# Altium schematic sheet HGD(v0.1)-20200419.SchDoc
size A2; SheetNumber: 0; SheetTotal: 0; PageSetup: Record=PageOptions|CenterHorizontal=True|CenterVertical=True|PrintScale=0.71|XCorrection=1.00|YCorrection=1.00|PrintKind=2|BorderSize=5000000|LeftOffset=0|BottomOffset=0|Orientation=2|PaperLength=1000|PaperWidth=1000|Scale=100|PaperSource=7|PrintQuality=-4|MediaType=1|DitherType=10|PaperKind=A3|PrintScaleMode=1
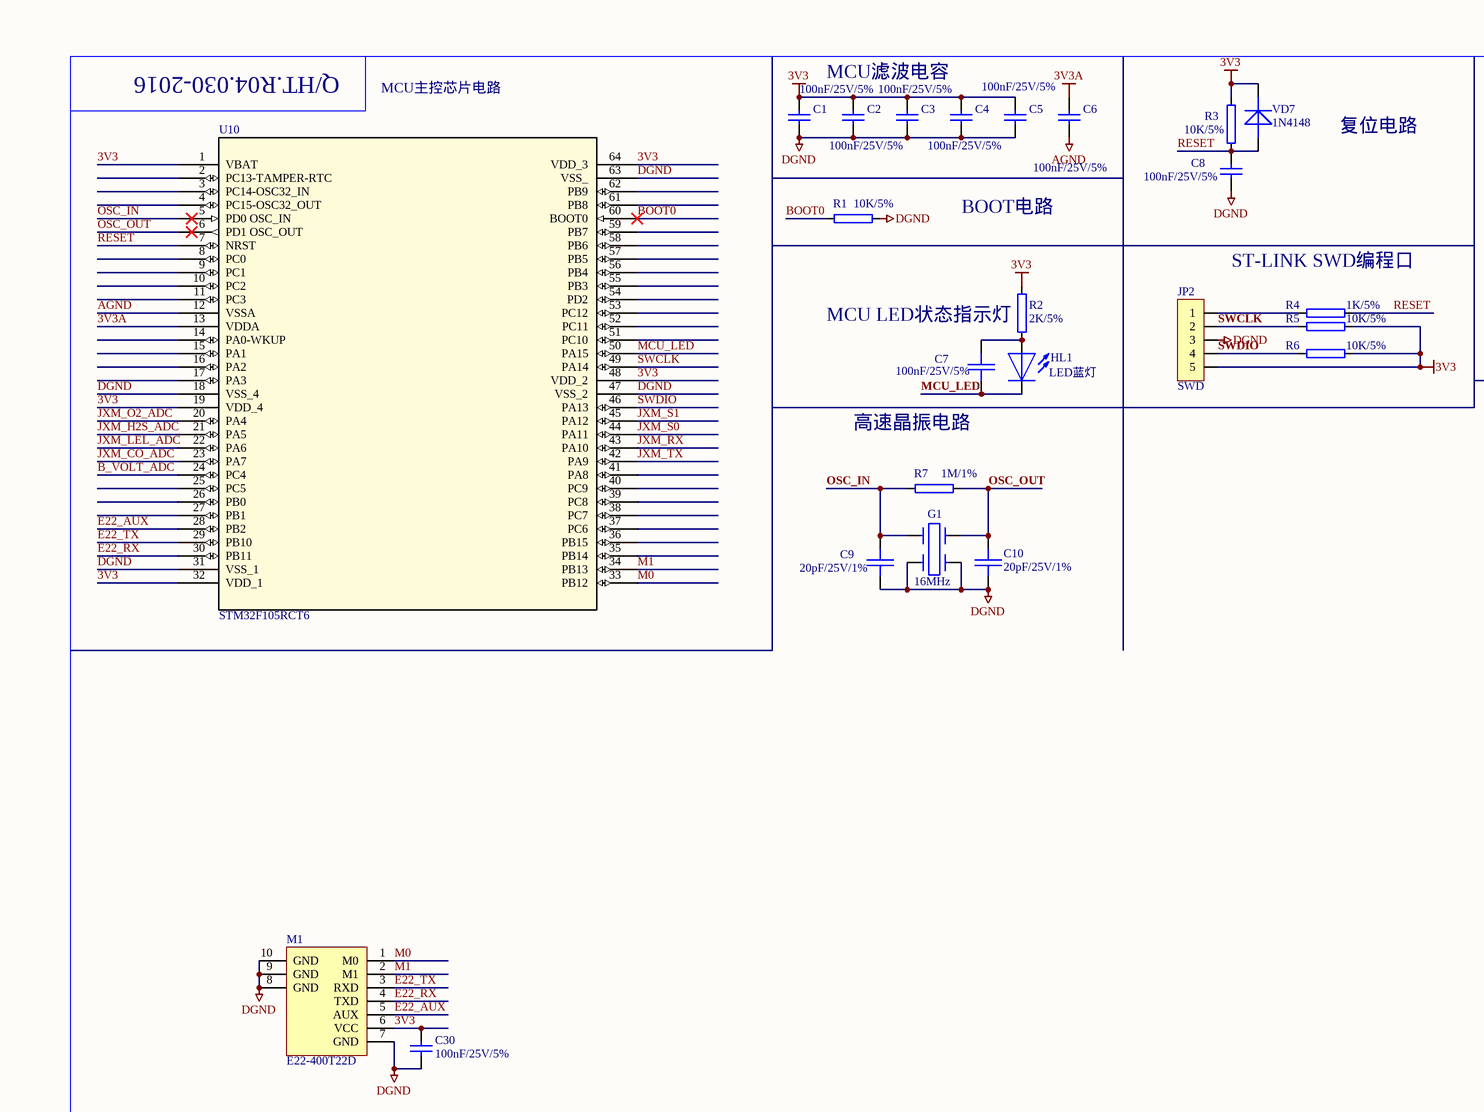
[diagram p0: HGD(v0.1)-20200419.SchDoc, top left]
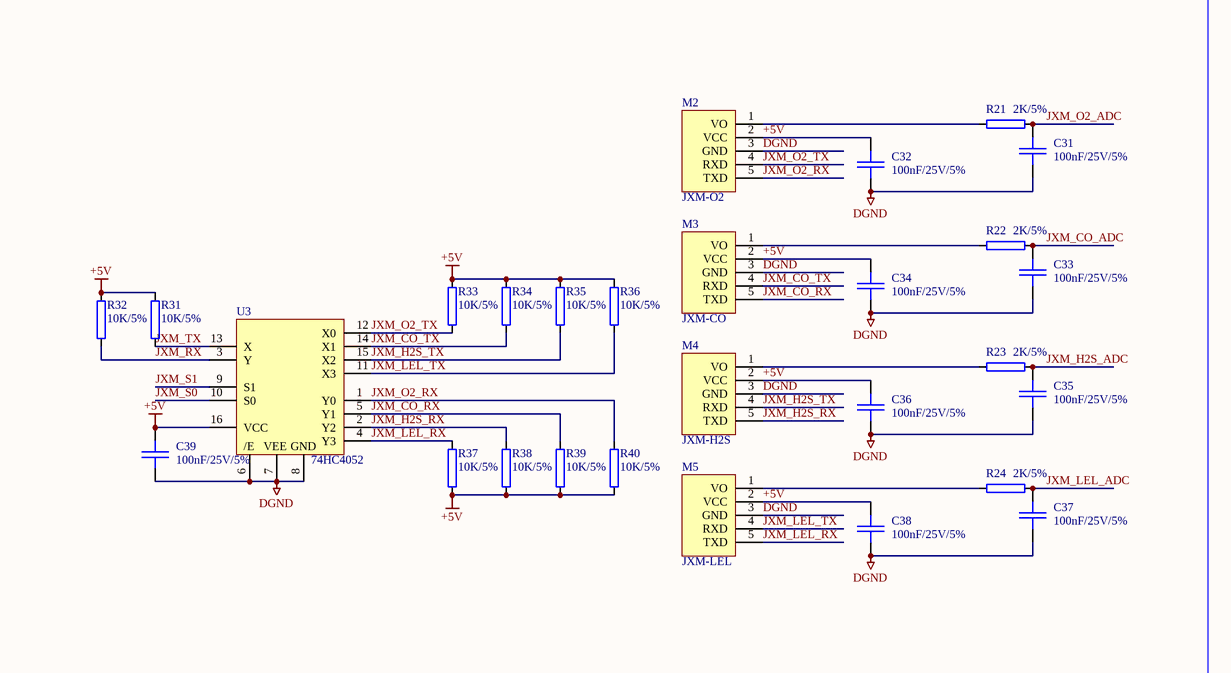
[diagram p1: HGD(v0.1)-20200419.SchDoc, top right]
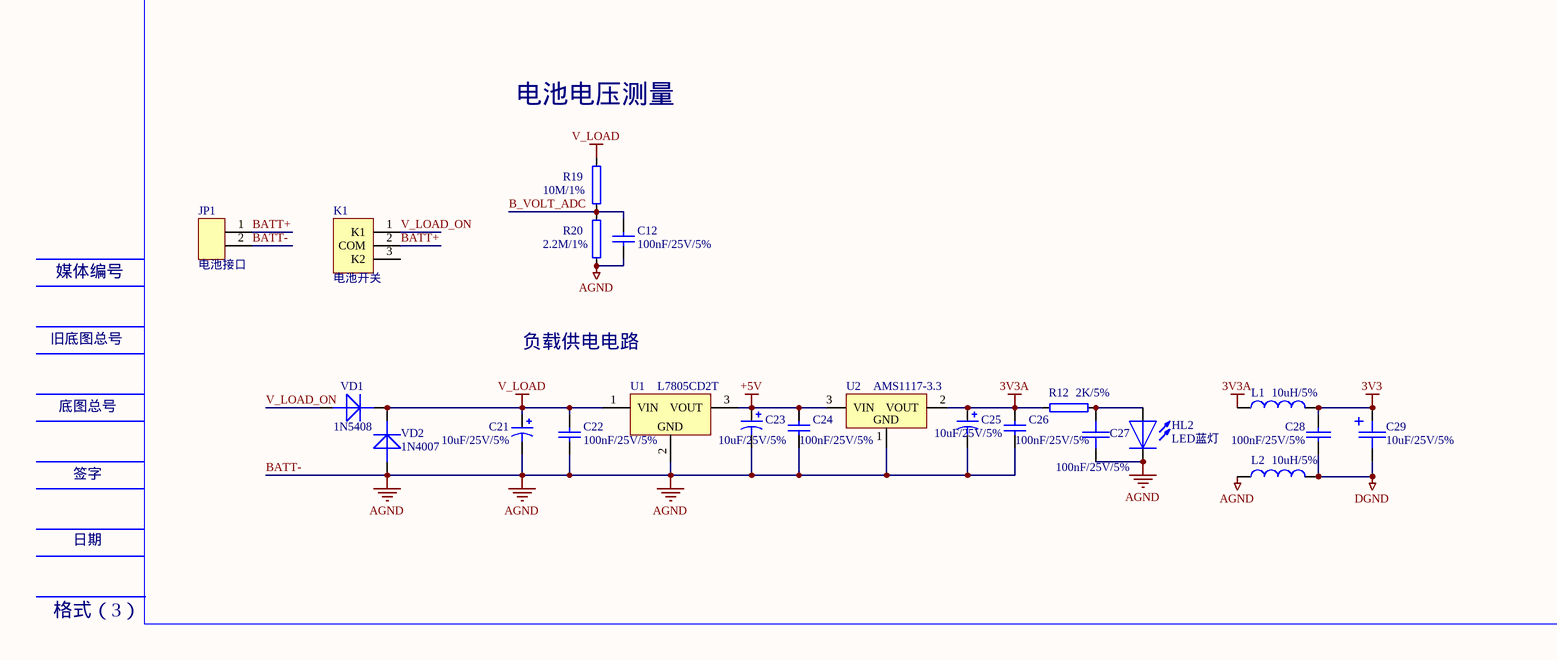
[diagram p2: HGD(v0.1)-20200419.SchDoc, bottom left]
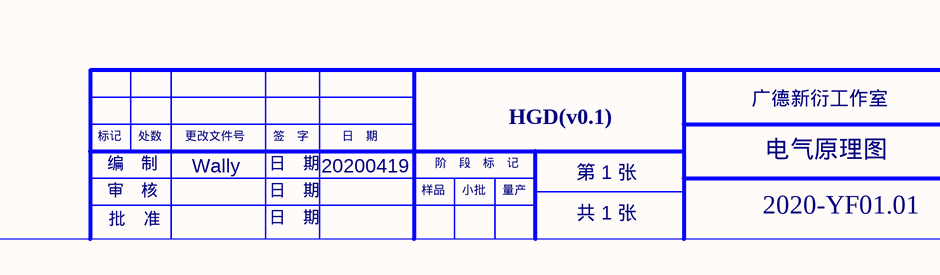
[diagram p3: HGD(v0.1)-20200419.SchDoc, bottom right]

## Parts
C1  100nF/25V/5%  [C0603]
C2  100nF/25V/5%  [C0603]
C3  100nF/25V/5%  [C0603]
C4  100nF/25V/5%  [C0603]
C5  100nF/25V/5%  [C0603]
C6  100nF/25V/5%  [C0603]
C7  100nF/25V/5%  [C0603]
C8  100nF/25V/5%  [C0603]
C9  20pF/25V/1%  [C0603]
C10  20pF/25V/1%  [C0603]
C12  100nF/25V/5%  [C0603]
C21  10uF/25V/5%  [C1206-1]
C22  100nF/25V/5%  [C0603]
C23  10uF/25V/5%  [C1206-1]
C24  100nF/25V/5%  [C0603]
C25  10uF/25V/5%  [C1206-1]
C26  100nF/25V/5%  [C0603]
C27  100nF/25V/5%  [C0603]
C28  100nF/25V/5%  [C0603]
C29  10uF/25V/5%  [C1206-1]
C30  100nF/25V/5%  [C0603]
C31  100nF/25V/5%  [C0603]
C32  100nF/25V/5%  [C0603]
C33  100nF/25V/5%  [C0603]
C34  100nF/25V/5%  [C0603]
C35  100nF/25V/5%  [C0603]
C36  100nF/25V/5%  [C0603]
C37  100nF/25V/5%  [C0603]
C38  100nF/25V/5%  [C0603]
C39  100nF/25V/5%  [C0603]
G1  16MHz  [OSC5032]
HL1  LED蓝灯  [LED0603]
HL2  LED蓝灯  [LED0603]
JP1  电池接口  [XH2.54-LI-2P]
JP2  SWD  [XH2.54-5AW]
K1  电池开关  [SK-12D07]
L1  10uH/5%  [L0603]
L2  10uH/5%  [L0603]
M1  E22-400T22D  [E22-400T22D]
M2  JXM-O2  [JXM]
M3  JXM-CO  [JXM]
M4  JXM-H2S  [JXM]
M5  JXM-LEL  [JXM]
R1  10K/5%  [R0603]
R2  2K/5%  [R0603]
R3  10K/5%  [R0603]
R4  1K/5%  [R0603]
R5  10K/5%  [R0603]
R6  10K/5%  [R0603]
R7  1M/1%  [R0603]
R12  2K/5%  [R0603]
R19  10M/1%  [R0603]
R20  2.2M/1%  [R0603]
R21  2K/5%  [R0603]
R22  2K/5%  [R0603]
R23  2K/5%  [R0603]
R24  2K/5%  [R0603]
R31  10K/5%  [R0603]
R32  10K/5%  [R0603]
R33  10K/5%  [R0603]
R34  10K/5%  [R0603]
R35  10K/5%  [R0603]
R36  10K/5%  [R0603]
R37  10K/5%  [R0603]
R38  10K/5%  [R0603]
R39  10K/5%  [R0603]
R40  10K/5%  [R0603]
U1  L7805CD2T  [D2PAK]
U2  AMS1117-3.3  [SOT230P700X180-4N]
U3  74HC4052  [SO16_74HC4052]
U10  STM32F105RCT6  [LQFP64]
VD1  1N5408  [SMA_DO-214AC]
VD2  1N4007  [SMA_DO-214AC]
VD7  1N4148  [LL-34]

## Nets
3V3: C1.2 C2.1 C3.1 C4.2 C5.2 C28.2 C29.1 C30.2 JP2.5 L1.2 M1.6(VCC) R2.1 R3.2 R5.2 R6.2 U10.1(VBAT) U10.19(VDD_4) U10.32(VDD_1) U10.48(VDD_2) U10.64(VDD_3) VD7.K
3V3A: C6.2 C25.1 C26.2 L1.1 R12.1 U2.2(VOUT) U10.13(VDDA)
+5V: C23.1 C24.2 C32.1 C34.1 C36.1 C38.1 C39.1 M2.2(VCC) M3.2(VCC) M4.2(VCC) M5.2(VCC) R31.2 R32.2 R33.2 R34.2 R35.2 R36.2 R37.1 R38.1 R39.1 R40.1 U1.3(VOUT) U2.3(VIN) U3.16(VCC)
AGND: C6.1 C12.2 C21.2 C22.1 C23.2 C24.1 C25.2 C26.1 C27.2 HL2.K JP1.2 L2.1 R20.2 U1.2(GND) U2.1(GND) U10.12(VSSA) VD2.A  [also labelled BATT-]
DGND: C1.1 C2.2 C3.2 C4.1 C5.1 C8.2 C9.1 C10.2 C28.1 C29.2 C30.1 C31.2 C32.2 C33.2 C34.2 C35.2 C36.2 C37.2 C38.2 C39.2 G1.2 G1.4 JP2.3 L2.2 M1.7(GND) M1.8(GND) M1.9(GND) M1.10(GND) M2.3(GND) M3.3(GND) M4.3(GND) M5.3(GND) R1.1 U3.6(~{E}) U3.7(VEE) U3.8(GND) U10.18(VSS_4) U10.31(VSS_1) U10.47(VSS_2) U10.63(VSS_)
V_LOAD: C21.1 C22.2 R19.1 U1.1(VIN) VD1.K VD2.K
B_VOLT_ADC: C12.1 R19.2 R20.1 U10.24(PC4)
BATT+: JP1.1 K1.2(COM)
BOOT0: R1.2 U10.60(BOOT0)
E22_AUX: M1.5(AUX) U10.28(PB2)
E22_RX: M1.4(TXD) U10.30(PB11)
E22_TX: M1.3(RXD) U10.29(PB10)
JXM_CO_ADC: C33.1 R22.1 U10.23(PA7)
JXM_CO_RX: M3.5(TXD) R39.2 U3.5(Y1)
JXM_CO_TX: M3.4(RXD) R34.1 U3.14(X1)
JXM_H2S_ADC: C35.1 R23.1 U10.21(PA5)
JXM_H2S_RX: M4.5(TXD) R38.2 U3.2(Y2)
JXM_H2S_TX: M4.4(RXD) R35.1 U3.15(X2)
JXM_LEL_ADC: C37.1 R24.1 U10.22(PA6)
JXM_LEL_RX: M5.5(TXD) R37.2 U3.4(Y3)
JXM_LEL_TX: M5.4(RXD) R36.1 U3.11(X3)
JXM_O2_ADC: C31.1 R21.1 U10.20(PA4)
JXM_O2_RX: M2.5(TXD) R40.2 U3.1(Y0)
JXM_O2_TX: M2.4(RXD) R33.1 U3.12(X0)
JXM_RX: R32.1 U3.3(Y) U10.43(PA10)
JXM_S0: U3.10(S0) U10.44(PA11)
JXM_S1: U3.9(S1) U10.45(PA12)
JXM_TX: R31.1 U3.13(X) U10.42(PA9)
M0: M1.1(M0) U10.33(PB12)
M1: M1.2(M1) U10.34(PB13)
MCU_LED: C7.2 HL1.K U10.50(PA15)
OSC_IN: C9.2 G1.1 R7.1 U10.5(PD0_OSC_IN)
OSC_OUT: C10.1 G1.3 R7.2 U10.6(PD1_OSC_OUT)
RESET: C8.1 R3.1 R4.2 U10.7(NRST) VD7.A
SWCLK: JP2.2 R5.1 U10.49(PA14)
SWDIO: JP2.4 R6.1 U10.46(PA13)
V_LOAD_ON: K1.1(K1) VD1.A
NetC7_1: C7.1 HL1.A R2.2
NetC27_1: C27.1 HL2.A R12.2
NetJP2_1: JP2.1 R4.1
NetM2_1: M2.1(VO) R21.2
NetM3_1: M3.1(VO) R22.2
NetM4_1: M4.1(VO) R23.2
NetM5_1: M5.1(VO) R24.2

Not connected (* = marked no-connect by the designer): K1 3(K2); U10 2(PC13-TAMPER-RTC) 3(PC14-OSC32_IN) 4(PC15-OSC32_OUT) 8(PC0) 9(PC1) 10(PC2) 11(PC3) 14(PA0-WKUP) 15(PA1) 16(PA2) 17(PA3) 25(PC5) 26(PB0) 27(PB1) 35(PB14) 36(PB15) 37(PC6) 38(PC7) 39(PC8) 40(PC9) 41(PA8) 51(PC10) 52(PC11) 53(PC12) 54(PD2) 55(PB3) 56(PB4) 57(PB5) 58(PB6) 59(PB7) 61(PB8) 62(PB9)

## Notes on the sheet
- Q/HT.R04.030-2016
- MCU主控芯片电路
- MCU滤波电容
- 复位电路
- BOOT电路
- ST-LINK SWD编程口
- (near C7) MCU LED状态指示灯
- 高速晶振电路
- 电池电压测量
- 媒体编号
- 旧底图总号
- 负载供电电路
- 底图总号
- 签字
- HGD(v0.1)
- 广德新衍工作室
- 日期
- 标记
- 编　制
- 审　核
- 处数
- 更改文件号
- Wally
- 日　期
- 签　字
- 20200419
- 样品
- 阶　段　标　记
- 小批
- 量产
- 第 1 张
- 电气原理图
- 格式（3）
- 批    准
- 共 1 张
- 2020-YF01.01
- (in symbol 74HC4052) /E

## Library data of the parts
C1-C6 C8 = CAP-SMD: 电容
C7 C9 C10 C27 C28 C31-C39 = CAP: 电容
C12 = CAP-SMD
C21 C23 C25 = Cap Pol1: 钽电容; Published: 8-Jun-2000; LatestRevisionDate: 17-Jul-2002; LatestRevisionNote: Re-released for DXP Platform.; PackageReference: RB7.6-15; Publisher: Altium Limited; Value: 10uF/25V/5%
C22 C24 C26 C30 = Cap: 电容; Published: 8-Jun-2000; LatestRevisionDate: 17-Jul-2002; LatestRevisionNote: Re-released for DXP Platform.; PackageReference: RAD-0.3; Publisher: Altium Limited; Value: 100nF/25V/5%
C29 = ELECTRO1: 钽电容
G1 = CRYSTAL_4: 两对电极压电晶体
HL1 HL2 = 发光二极管
JP1 = XH2.54-2P/PH2.0-2P: XH2.54-2P/PH2.0-2P插座
JP2 = JP_XH2.54-5AW: XH2.54-5P直插插针
K1 = SK-12D07: SK-12D07：3脚2档小型拨动开关
L1 L2 = 电感
M1 = E22-400T22D: E22-400T22D LoRa模块
M2-M5 = JXM: JXM智能气体模组传感器
R1-R7 R12 R19-R24 R31-R40 = RES2: 电阻
U1 = L7805CD2T: Positive voltage regulator
U2 = U_AMS1117: U_AMS1117稳压芯片
U10 = STM32F103RCT6: MCU; Vendor: ST Microelectronics; Description: MCU ARM 32BIT 256KB FLASH 64LQFP; Core Processor: ARM?? Cortex???-M3; Core Size: 32-Bit; Speed: 72MHz; Connectivity: CAN, I??C, IrDA, LIN, SPI, UART/USART, USB; Peripherals: DMA, Motor Control PWM, PDR, POR, PVD, PWM, Temp Sensor, WDT; Number of I /O: 51; Program Memory Size: 256KB (256K x 8); Program Memory Type: FLASH; RAM Size: 48K x 8; Voltage - Supply (Vcc/Vdd): 2 V ~ 3.6 V; Data Converters: A/D 16x12b; D/A 2x12b; Oscillator Type: Internal; C: Copyright (C) 2015 Accelerated Designs. All rights reserved; Manufacturer_Part_Number: STM32F103RCT6; DigiKeyPartNumber: 497-9033-ND; Quantity_Available: 2442; DataSheet: http://www.st.com/internet/com/TECHNICAL_RESOURCES/TECHNICAL_LITERATURE/DATASHEET/CD00191185.pdf; EEPROM Size: -; Operating Temperature: -40??C ~ 85??C; Package / Case: 64-LQFP; Packaging: Tray; Copyright: Copyright (C) 2015 Accelerated Designs. All rights reserved; RefDes: RefDes; Type: Type; Value: Value
VD1 VD2 VD7 = 开关二极管